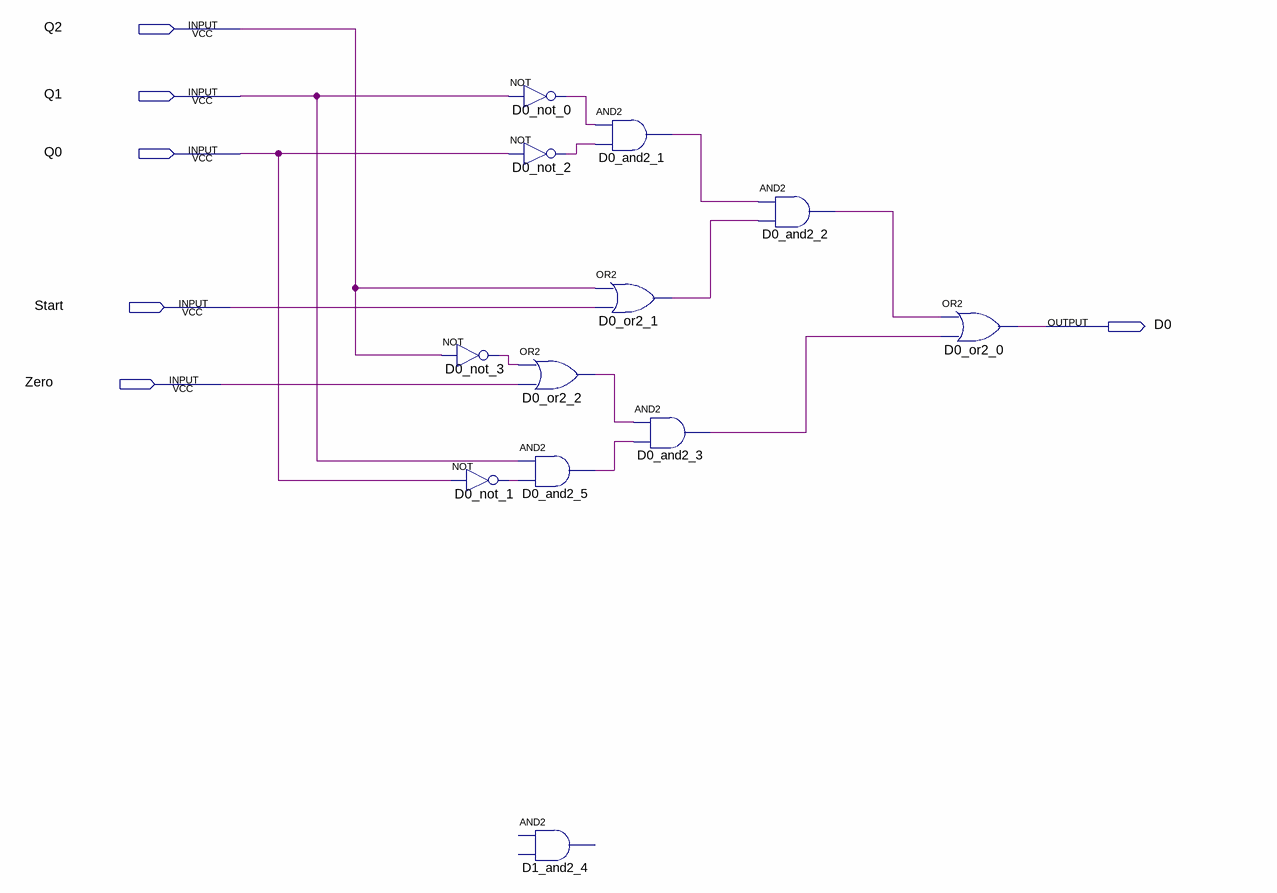
[diagram p0: schematic sheet]
// Quartus schematic D0_control.bdf as structural Verilog: 12 symbols, 6 pins
module D0_control (
  input  Q2,
  input  Q1,
  input  Q0,
  input  Start,
  input  Zero,
  output D0
);

  wire D0_and2_1_out, D0_and2_2_out, D0_and2_3_out, D0_and2_5_out, D0_not_0_out, D0_not_1_out, D0_not_2_out,
       D0_not_3_out, D0_or2_1_out, D0_or2_2_out;

  not D0_not_3 (D0_not_3_out, Q2);
  not D0_not_1 (D0_not_1_out, Q0);
  not D0_not_0 (D0_not_0_out, Q1);
  not D0_not_2 (D0_not_2_out, Q0);
  or D0_or2_2 (D0_or2_2_out, D0_not_3_out, Zero);
  and D0_and2_5 (D0_and2_5_out, Q1, D0_not_1_out);
  // AND2 D1_and2_4 is placed but not wired
  and D0_and2_1 (D0_and2_1_out, D0_not_0_out, D0_not_2_out);
  or D0_or2_1 (D0_or2_1_out, Q2, Start);
  and D0_and2_3 (D0_and2_3_out, D0_or2_2_out, D0_and2_5_out);
  and D0_and2_2 (D0_and2_2_out, D0_and2_1_out, D0_or2_1_out);
  or D0_or2_0 (D0, D0_and2_2_out, D0_and2_3_out);
endmodule
